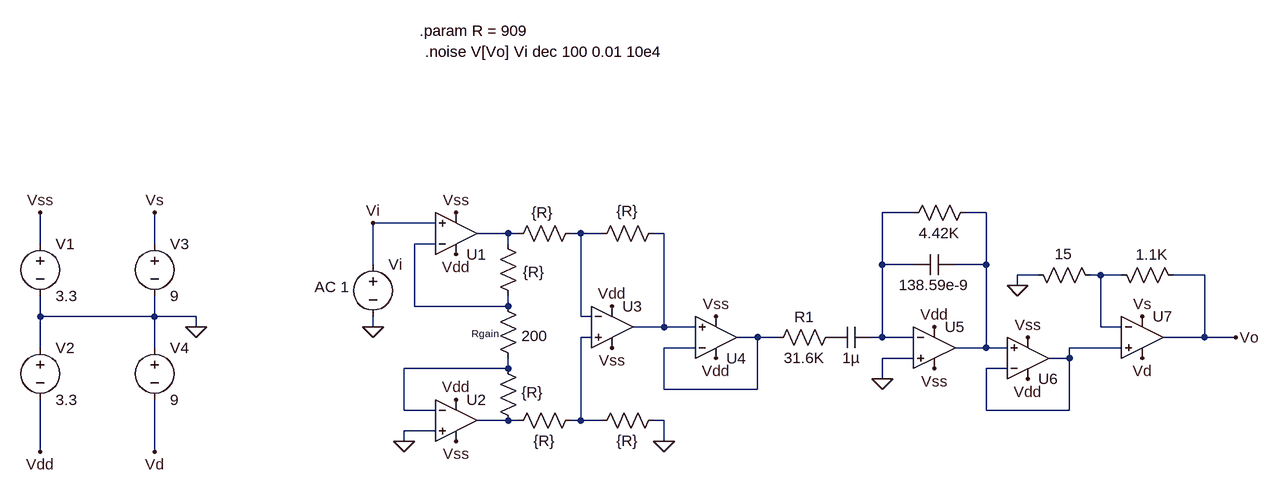
[diagram p0: schematic EMG Sensor.asc]
EMG Sensor.asc, the LTspice schematic file:
Version 4
SHEET 1 1376 744
WIRE 832 -80 784 -80
WIRE 944 -80 912 -80
WIRE 96 -64 0 -64
WIRE 208 -48 160 -48
WIRE 224 -48 208 -48
WIRE 320 -48 304 -48
WIRE 352 -48 320 -48
WIRE 448 -48 432 -48
WIRE -512 -32 -512 -80
WIRE -336 -32 -336 -80
WIRE 96 -32 64 -32
WIRE 208 -32 208 -48
WIRE 0 0 0 -64
WIRE 784 0 784 -80
WIRE 832 0 784 0
WIRE 944 0 944 -80
WIRE 944 0 896 0
WIRE 1024 16 992 16
WIRE 1120 16 1104 16
WIRE 1152 16 1120 16
WIRE 1280 16 1232 16
WIRE 992 32 992 16
WIRE 64 64 64 -32
WIRE 208 64 208 48
WIRE 208 64 64 64
WIRE -512 80 -512 48
WIRE -336 80 -336 48
WIRE -336 80 -512 80
WIRE -272 80 -336 80
WIRE 320 80 320 -48
WIRE 336 80 320 80
WIRE -272 96 -272 80
WIRE 0 96 0 80
WIRE 448 96 448 -48
WIRE 448 96 400 96
WIRE 496 96 448 96
WIRE 1120 96 1120 16
WIRE 1152 96 1120 96
WIRE 336 112 320 112
WIRE 592 112 560 112
WIRE 624 112 592 112
WIRE 784 112 784 0
WIRE 784 112 768 112
WIRE 832 112 784 112
WIRE 1280 112 1280 16
WIRE 1280 112 1216 112
WIRE 1328 112 1280 112
WIRE -512 128 -512 80
WIRE -336 128 -336 80
WIRE 496 128 448 128
WIRE 944 128 944 0
WIRE 944 128 896 128
WIRE 976 128 944 128
WIRE 1152 128 1072 128
WIRE 832 144 784 144
WIRE 1072 144 1072 128
WIRE 1072 144 1040 144
WIRE 208 160 208 144
WIRE 208 160 48 160
WIRE 976 160 944 160
WIRE 784 176 784 144
WIRE 448 192 448 128
WIRE 592 192 592 112
WIRE 592 192 448 192
WIRE 48 224 48 160
WIRE 96 224 48 224
WIRE 944 224 944 160
WIRE 1072 224 1072 144
WIRE 1072 224 944 224
WIRE 208 240 160 240
WIRE 224 240 208 240
WIRE 320 240 320 112
WIRE 320 240 304 240
WIRE 352 240 320 240
WIRE 448 240 432 240
WIRE 96 256 48 256
WIRE 48 272 48 256
WIRE 448 272 448 240
WIRE -512 288 -512 208
WIRE -336 288 -336 208
FLAG 448 272 0
FLAG 48 272 0
FLAG 0 96 0
FLAG -512 -80 Vss
FLAG -512 288 Vdd
FLAG -336 288 Vd
FLAG -336 -80 Vs
FLAG 528 144 Vdd
FLAG 528 80 Vss
FLAG 128 272 Vss
FLAG 368 128 Vss
FLAG 368 64 Vdd
FLAG 128 208 Vdd
FLAG 128 -80 Vss
FLAG 128 -16 Vdd
FLAG 784 176 0
FLAG 864 160 Vss
FLAG 864 96 Vdd
FLAG 1008 176 Vdd
FLAG 1008 112 Vss
FLAG 992 32 0
FLAG 1184 80 Vs
FLAG 1184 144 Vd
FLAG 1328 112 Vo
FLAG -272 96 0
FLAG 0 -64 Vi
SYMBOL voltage 0 -16 R0
WINDOW 3 -270 53 Invisible 2
WINDOW 123 -90 50 Left 2
SYMATTR Value 0
SYMATTR InstName Vi
SYMATTR Value2 AC 1
SYMBOL res 192 48 R0
WINDOW 0 -40 58 Left 1
WINDOW 3 37 62 Left 2
SYMATTR InstName Rgain
SYMATTR Value 200
SYMBOL res 192 -48 R0
WINDOW 0 36 40 Invisible 2
WINDOW 3 39 59 Left 2
SYMATTR InstName R2
SYMATTR Value {R}
SYMBOL res 192 144 R0
WINDOW 0 36 40 Invisible 2
WINDOW 3 37 53 Left 2
SYMATTR InstName R3
SYMATTR Value {R}
SYMBOL res 320 -64 R90
WINDOW 0 0 56 Invisible 2
WINDOW 3 -32 59 VTop 2
SYMATTR InstName R4
SYMATTR Value {R}
SYMBOL res 320 224 R90
WINDOW 0 0 56 Invisible 2
WINDOW 3 32 56 VTop 2
SYMATTR InstName R5
SYMATTR Value {R}
SYMBOL res 448 224 R90
WINDOW 0 0 56 Invisible 2
WINDOW 3 32 56 VTop 2
SYMATTR InstName R6
SYMATTR Value {R}
SYMBOL res 448 -64 R90
WINDOW 0 0 56 Invisible 2
WINDOW 3 -34 56 VTop 2
SYMATTR InstName R7
SYMATTR Value {R}
SYMBOL UniversalOpAmp1 128 240 R0
SYMATTR InstName U2
SYMBOL UniversalOpAmp1 368 96 R0
SYMATTR InstName U3
SYMBOL voltage -336 -48 R0
SYMATTR InstName V3
SYMATTR Value 9
SYMBOL voltage -336 112 R0
SYMATTR InstName V4
SYMATTR Value 9
SYMBOL UniversalOpAmp 528 112 M180
SYMATTR InstName U4
SYMBOL UniversalOpAmp 128 -48 M180
SYMATTR InstName U1
SYMBOL res 720 96 R90
WINDOW 0 0 56 VBottom 2
WINDOW 3 32 56 VTop 2
SYMATTR InstName R1
SYMATTR Value 31.6K
SYMBOL cap 768 96 R90
WINDOW 0 0 32 Invisible 2
WINDOW 3 32 32 VTop 2
SYMATTR InstName C1
SYMATTR Value 1µ
SYMATTR SpiceLine Rser=11 Lser=0 mfg="AVX" pn="TAJA105K016" type="Tantalum"
SYMBOL cap 896 -16 R90
WINDOW 0 0 32 Invisible 2
WINDOW 3 32 32 VTop 2
SYMATTR InstName C2
SYMATTR Value 138.59e-9
SYMBOL res 928 -96 R90
WINDOW 0 0 56 Invisible 2
WINDOW 3 32 56 VTop 2
SYMATTR InstName R8
SYMATTR Value 4.42K
SYMBOL UniversalOpAmp1 864 128 R0
SYMATTR InstName U5
SYMBOL UniversalOpAmp 1008 144 M180
SYMATTR InstName U6
SYMBOL UniversalOpAmp1 1184 112 R0
SYMATTR InstName U7
SYMBOL res 1008 0 M90
WINDOW 0 0 56 Invisible 2
WINDOW 3 -32 55 VTop 2
SYMATTR InstName R9
SYMATTR Value 15
SYMBOL res 1248 32 M270
WINDOW 0 32 56 Invisible 2
WINDOW 3 63 49 VBottom 2
SYMATTR InstName R10
SYMATTR Value 1.1K
SYMBOL voltage -512 -48 R0
SYMATTR InstName V1
SYMATTR Value 3.3
SYMBOL voltage -512 112 R0
SYMATTR InstName V2
SYMATTR Value 3.3
TEXT 72 -360 Left 2 !.param R = 909
TEXT 80 -328 Left 2 !.noise V[Vo] Vi dec 100 0.01 10e4

The netlist it stands for:
* EMG Sensor.asc
Vi Vi 0 0 AC 1
Rgain N006 N011 200
R2 N003 N006 {R}
R3 N011 N012 {R}
R4 N004 N003 {R}
R5 N008 N012 {R}
R6 0 N008 {R}
R7 N005 N004 {R}
XU2 0 N011 Vdd Vss N012 level1 Avol=1Meg GBW=10Meg Vos=0 En=0 Enk=0 In=0 Ink=0 Rin=500Meg  ; pins In+ In- V+ V- OUT
XU3 N008 N004 Vdd Vss N005 level1 Avol=1Meg GBW=10Meg Vos=0 En=0 Enk=0 In=0 Ink=0 Rin=500Meg  ; pins In+ In- V+ V- OUT
V3 Vs 0 9
V4 0 Vd 9
XU4 N005 N009 Vdd Vss N009 level1 Avol=1Meg GBW=10Meg Vos=0 En=0 Enk=0 In=0 Ink=0 Rin=500Meg  ; pins In+ In- V+ V- OUT
XU1 Vi N006 Vdd Vss N003 level1 Avol=1Meg GBW=10Meg Vos=0 En=0 Enk=0 In=0 Ink=0 Rin=500Meg  ; pins In+ In- V+ V- OUT
R1 P001 N009 31.6K
C1 N001 P001 1µ Rser=11 Lser=0 mfg="AVX" pn="TAJA105K016" type="Tantalum"
C2 N002 N001 138.59e-9
R8 N002 N001 4.42K
XU5 0 N001 Vdd Vss N002 level1 Avol=1Meg GBW=10Meg Vos=0 En=0 Enk=0 In=0 Ink=0 Rin=500Meg  ; pins In+ In- V+ V- OUT
XU6 N002 N010 Vdd Vss N010 level1 Avol=1Meg GBW=10Meg Vos=0 En=0 Enk=0 In=0 Ink=0 Rin=500Meg  ; pins In+ In- V+ V- OUT
XU7 N010 N007 Vs Vd Vo level1 Avol=1Meg GBW=10Meg Vos=0 En=0 Enk=0 In=0 Ink=0 Rin=500Meg  ; pins In+ In- V+ V- OUT
R9 0 N007 15
R10 Vo N007 1.1K
V1 Vss 0 3.3
V2 0 Vdd 3.3
.param R = 909
.noise V[Vo] Vi dec 100 0.01 10e4
.lib UniversalOpAmp1.lib
.backanno
.end